# EAGLE design cm4_adc (EAGLE 9.6.2)

## Sheet 1 of 2
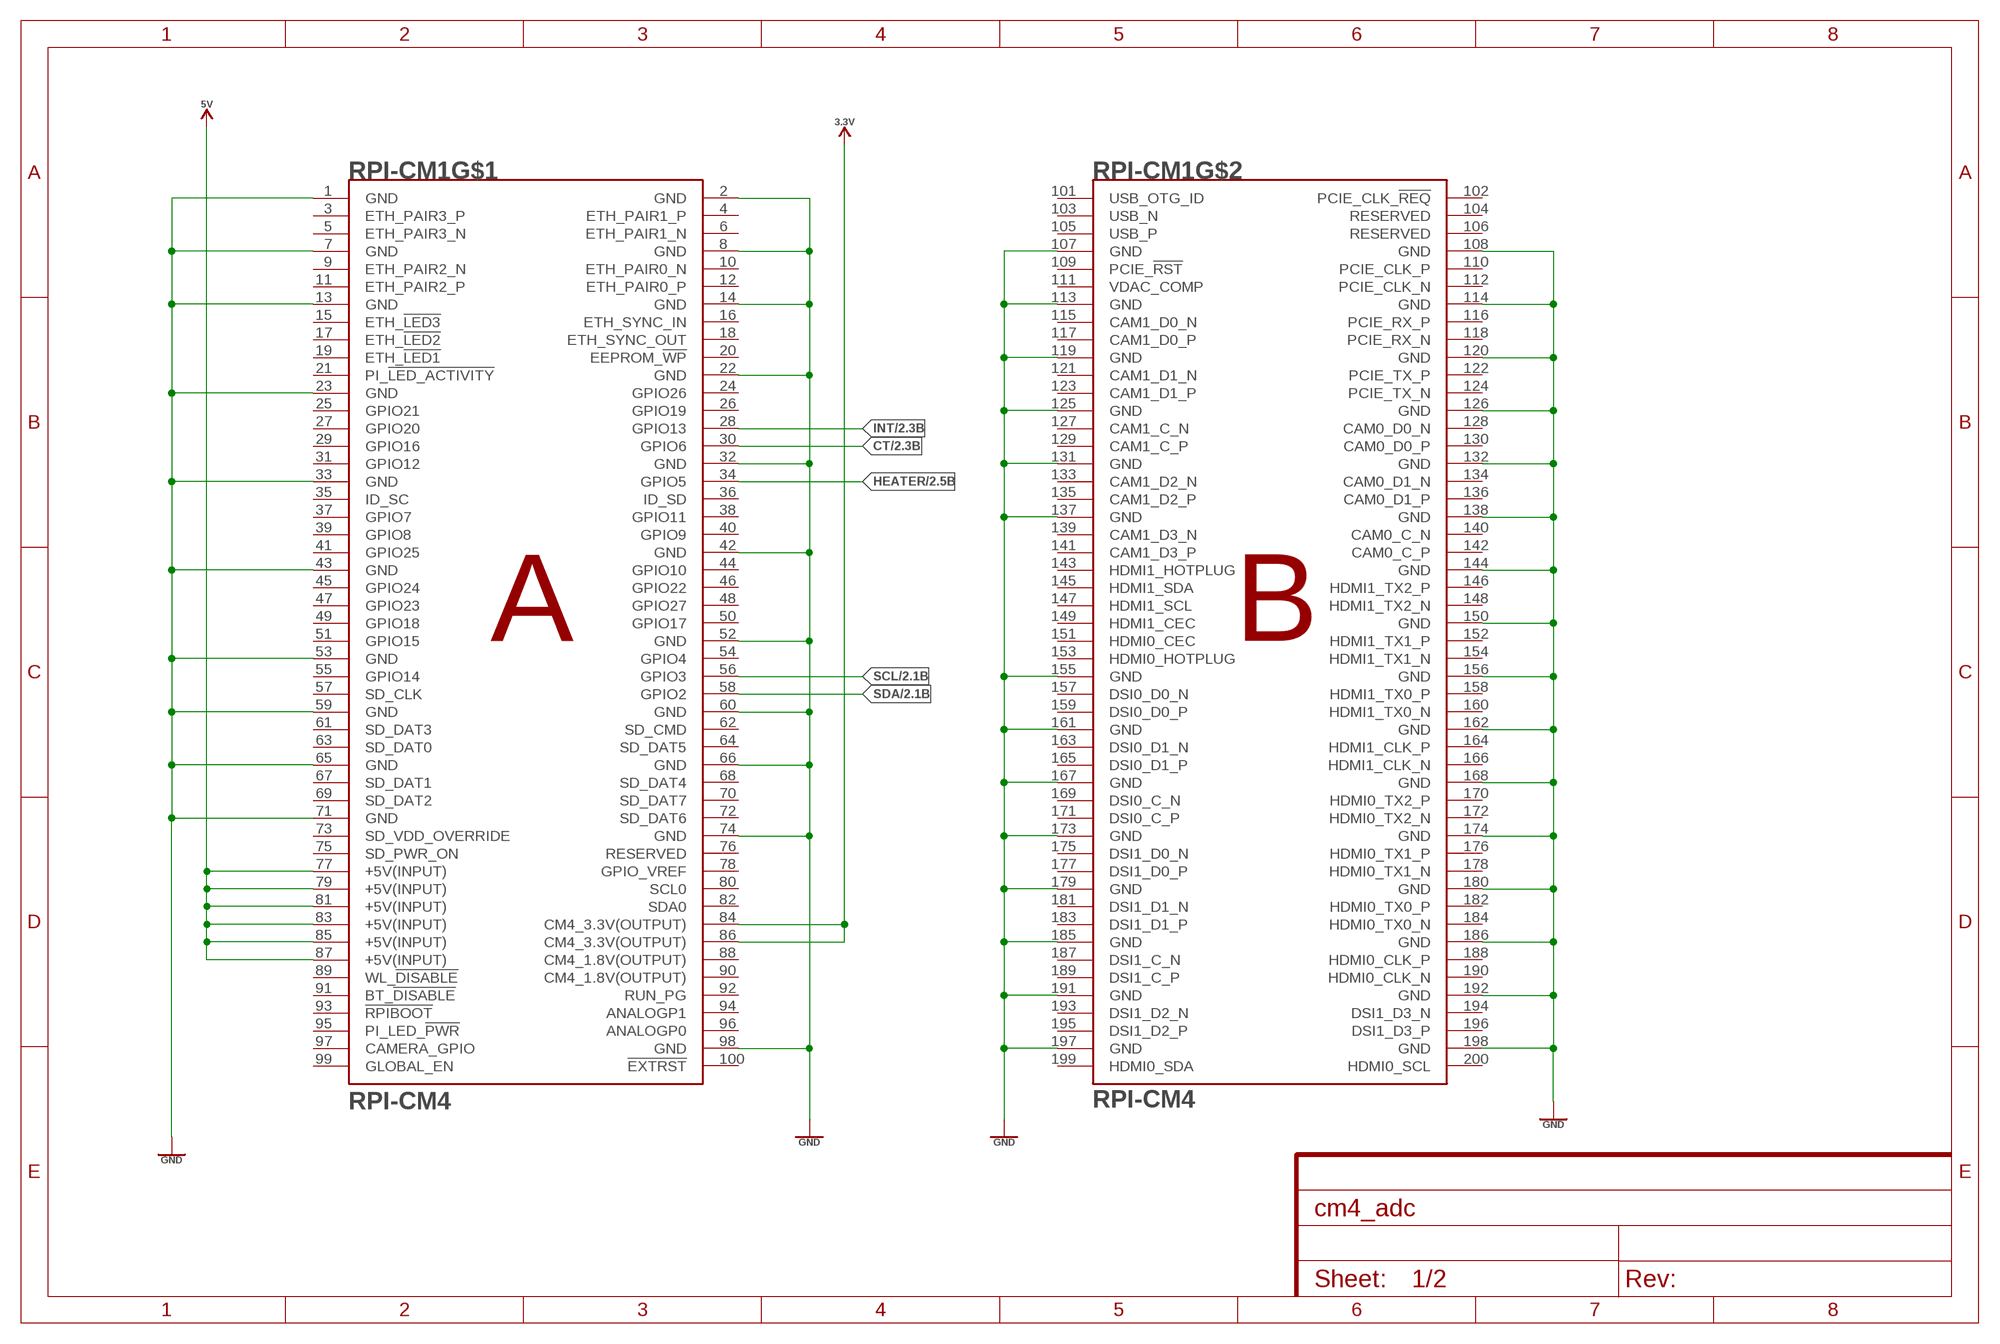
[diagram p0: schematic, sheet 1]

### Parts
RPI-CM1  RPI-CM4  [RPI-CM4]

### Nets
3.3V: RPI-CM1.84(CM4_3.3V(OUTPUT)) RPI-CM1.86(CM4_3.3V(OUTPUT)) ; also sheet 2
5V: RPI-CM1.77(+5V(INPUT)) RPI-CM1.79(+5V(INPUT)) RPI-CM1.81(+5V(INPUT)) RPI-CM1.83(+5V(INPUT)) RPI-CM1.85(+5V(INPUT)) RPI-CM1.87(+5V(INPUT)) ; also sheet 2
CT: RPI-CM1.30(GPIO6) ; also sheet 2
GND: RPI-CM1.1(GND) RPI-CM1.2(GND) RPI-CM1.7(GND) RPI-CM1.8(GND) RPI-CM1.13(GND) RPI-CM1.14(GND) RPI-CM1.22(GND) RPI-CM1.23(GND) RPI-CM1.32(GND) RPI-CM1.33(GND) RPI-CM1.42(GND) RPI-CM1.43(GND) RPI-CM1.52(GND) RPI-CM1.53(GND) RPI-CM1.59(GND) RPI-CM1.60(GND) RPI-CM1.65(GND) RPI-CM1.66(GND) RPI-CM1.71(GND) RPI-CM1.74(GND) RPI-CM1.98(GND) RPI-CM1.107(GND) RPI-CM1.108(GND) RPI-CM1.113(GND) RPI-CM1.114(GND) RPI-CM1.119(GND) RPI-CM1.120(GND) RPI-CM1.125(GND) RPI-CM1.126(GND) RPI-CM1.131(GND) RPI-CM1.132(GND) RPI-CM1.137(GND) RPI-CM1.138(GND) RPI-CM1.144(GND) RPI-CM1.150(GND) RPI-CM1.155(GND) RPI-CM1.156(GND) RPI-CM1.161(GND) RPI-CM1.162(GND) RPI-CM1.167(GND) RPI-CM1.168(GND) RPI-CM1.173(GND) RPI-CM1.174(GND) RPI-CM1.179(GND) RPI-CM1.180(GND) RPI-CM1.185(GND) RPI-CM1.186(GND) RPI-CM1.191(GND) RPI-CM1.192(GND) RPI-CM1.197(GND) RPI-CM1.198(GND) ; also sheet 2
HEATER: RPI-CM1.34(GPIO5) ; also sheet 2
INT: RPI-CM1.28(GPIO13) ; also sheet 2
SCL: RPI-CM1.56(GPIO3) ; also sheet 2
SDA: RPI-CM1.58(GPIO2) ; also sheet 2
Unconnected: RPI-CM1.3(ETH_PAIR3_P) RPI-CM1.4(ETH_PAIR1_P) RPI-CM1.5(ETH_PAIR3_N) RPI-CM1.6(ETH_PAIR1_N) RPI-CM1.9(ETH_PAIR2_N) RPI-CM1.10(ETH_PAIR0_N) RPI-CM1.11(ETH_PAIR2_P) RPI-CM1.12(ETH_PAIR0_P) RPI-CM1.15(ETH_!LED3) RPI-CM1.16(ETH_SYNC_IN) RPI-CM1.17(ETH_!LED2) RPI-CM1.18(ETH_SYNC_OUT) RPI-CM1.19(ETH_!LED1) RPI-CM1.20(EEPROM_!WP) RPI-CM1.21(PI_!LED_ACTIVITY) RPI-CM1.24(GPIO26) RPI-CM1.25(GPIO21) RPI-CM1.26(GPIO19) RPI-CM1.27(GPIO20) RPI-CM1.29(GPIO16) RPI-CM1.31(GPIO12) RPI-CM1.35(ID_SC) RPI-CM1.36(ID_SD) RPI-CM1.37(GPIO7) RPI-CM1.38(GPIO11) RPI-CM1.39(GPIO8) RPI-CM1.40(GPIO9) RPI-CM1.41(GPIO25) RPI-CM1.44(GPIO10) RPI-CM1.45(GPIO24) RPI-CM1.46(GPIO22) RPI-CM1.47(GPIO23) RPI-CM1.48(GPIO27) RPI-CM1.49(GPIO18) RPI-CM1.50(GPIO17) RPI-CM1.51(GPIO15) RPI-CM1.54(GPIO4) RPI-CM1.55(GPIO14) RPI-CM1.57(SD_CLK) RPI-CM1.61(SD_DAT3) RPI-CM1.62(SD_CMD) RPI-CM1.63(SD_DAT0) RPI-CM1.64(SD_DAT5) RPI-CM1.67(SD_DAT1) RPI-CM1.68(SD_DAT4) RPI-CM1.69(SD_DAT2) RPI-CM1.70(SD_DAT7) RPI-CM1.72(SD_DAT6) RPI-CM1.73(SD_VDD_OVERRIDE) RPI-CM1.75(SD_PWR_ON) RPI-CM1.76(RESERVED) RPI-CM1.78(GPIO_VREF) RPI-CM1.80(SCL0) RPI-CM1.82(SDA0) RPI-CM1.88(CM4_1.8V(OUTPUT)) RPI-CM1.89(WL_!DISABLE) RPI-CM1.90(CM4_1.8V(OUTPUT)) RPI-CM1.91(BT_!DISABLE) RPI-CM1.92(RUN_PG) RPI-CM1.93(!RPIBOOT) RPI-CM1.94(ANALOGP1) RPI-CM1.95(PI_LED_!PWR) RPI-CM1.96(ANALOGP0) RPI-CM1.97(CAMERA_GPIO) RPI-CM1.99(GLOBAL_EN) RPI-CM1.100(!EXTRST) RPI-CM1.101(USB_OTG_ID) RPI-CM1.102(PCIE_CLK_!REQ) RPI-CM1.103(USB_N) RPI-CM1.104(RESERVED) RPI-CM1.105(USB_P) RPI-CM1.106(RESERVED) RPI-CM1.109(PCIE_!RST) RPI-CM1.110(PCIE_CLK_P) RPI-CM1.111(VDAC_COMP) RPI-CM1.112(PCIE_CLK_N) RPI-CM1.115(CAM1_D0_N) RPI-CM1.116(PCIE_RX_P) RPI-CM1.117(CAM1_D0_P) RPI-CM1.118(PCIE_RX_N) RPI-CM1.121(CAM1_D1_N) RPI-CM1.122(PCIE_TX_P) RPI-CM1.123(CAM1_D1_P) RPI-CM1.124(PCIE_TX_N) RPI-CM1.127(CAM1_C_N) RPI-CM1.128(CAM0_D0_N) RPI-CM1.129(CAM1_C_P) RPI-CM1.130(CAM0_D0_P) RPI-CM1.133(CAM1_D2_N) RPI-CM1.134(CAM0_D1_N) RPI-CM1.135(CAM1_D2_P) RPI-CM1.136(CAM0_D1_P) RPI-CM1.139(CAM1_D3_N) RPI-CM1.140(CAM0_C_N) RPI-CM1.141(CAM1_D3_P) RPI-CM1.142(CAM0_C_P) RPI-CM1.143(HDMI1_HOTPLUG) RPI-CM1.145(HDMI1_SDA) RPI-CM1.146(HDMI1_TX2_P) RPI-CM1.147(HDMI1_SCL) RPI-CM1.148(HDMI1_TX2_N) RPI-CM1.149(HDMI1_CEC) RPI-CM1.151(HDMI0_CEC) RPI-CM1.152(HDMI1_TX1_P) RPI-CM1.153(HDMI0_HOTPLUG) RPI-CM1.154(HDMI1_TX1_N) RPI-CM1.157(DSI0_D0_N) RPI-CM1.158(HDMI1_TX0_P) RPI-CM1.159(DSI0_D0_P) RPI-CM1.160(HDMI1_TX0_N) RPI-CM1.163(DSI0_D1_N) RPI-CM1.164(HDMI1_CLK_P) RPI-CM1.165(DSI0_D1_P) RPI-CM1.166(HDMI1_CLK_N) RPI-CM1.169(DSI0_C_N) RPI-CM1.170(HDMI0_TX2_P) RPI-CM1.171(DSI0_C_P) RPI-CM1.172(HDMI0_TX2_N) RPI-CM1.175(DSI1_D0_N) RPI-CM1.176(HDMI0_TX1_P) RPI-CM1.177(DSI1_D0_P) RPI-CM1.178(HDMI0_TX1_N) RPI-CM1.181(DSI1_D1_N) RPI-CM1.182(HDMI0_TX0_P) RPI-CM1.183(DSI1_D1_P) RPI-CM1.184(HDMI0_TX0_N) RPI-CM1.187(DSI1_C_N) RPI-CM1.188(HDMI0_CLK_P) RPI-CM1.189(DSI1_C_P) RPI-CM1.190(HDMI0_CLK_N) RPI-CM1.193(DSI1_D2_N) RPI-CM1.194(DSI1_D3_N) RPI-CM1.195(DSI1_D2_P) RPI-CM1.196(DSI1_D3_P) RPI-CM1.199(HDMI0_SDA) RPI-CM1.200(HDMI0_SCL)

## Sheet 2 of 2
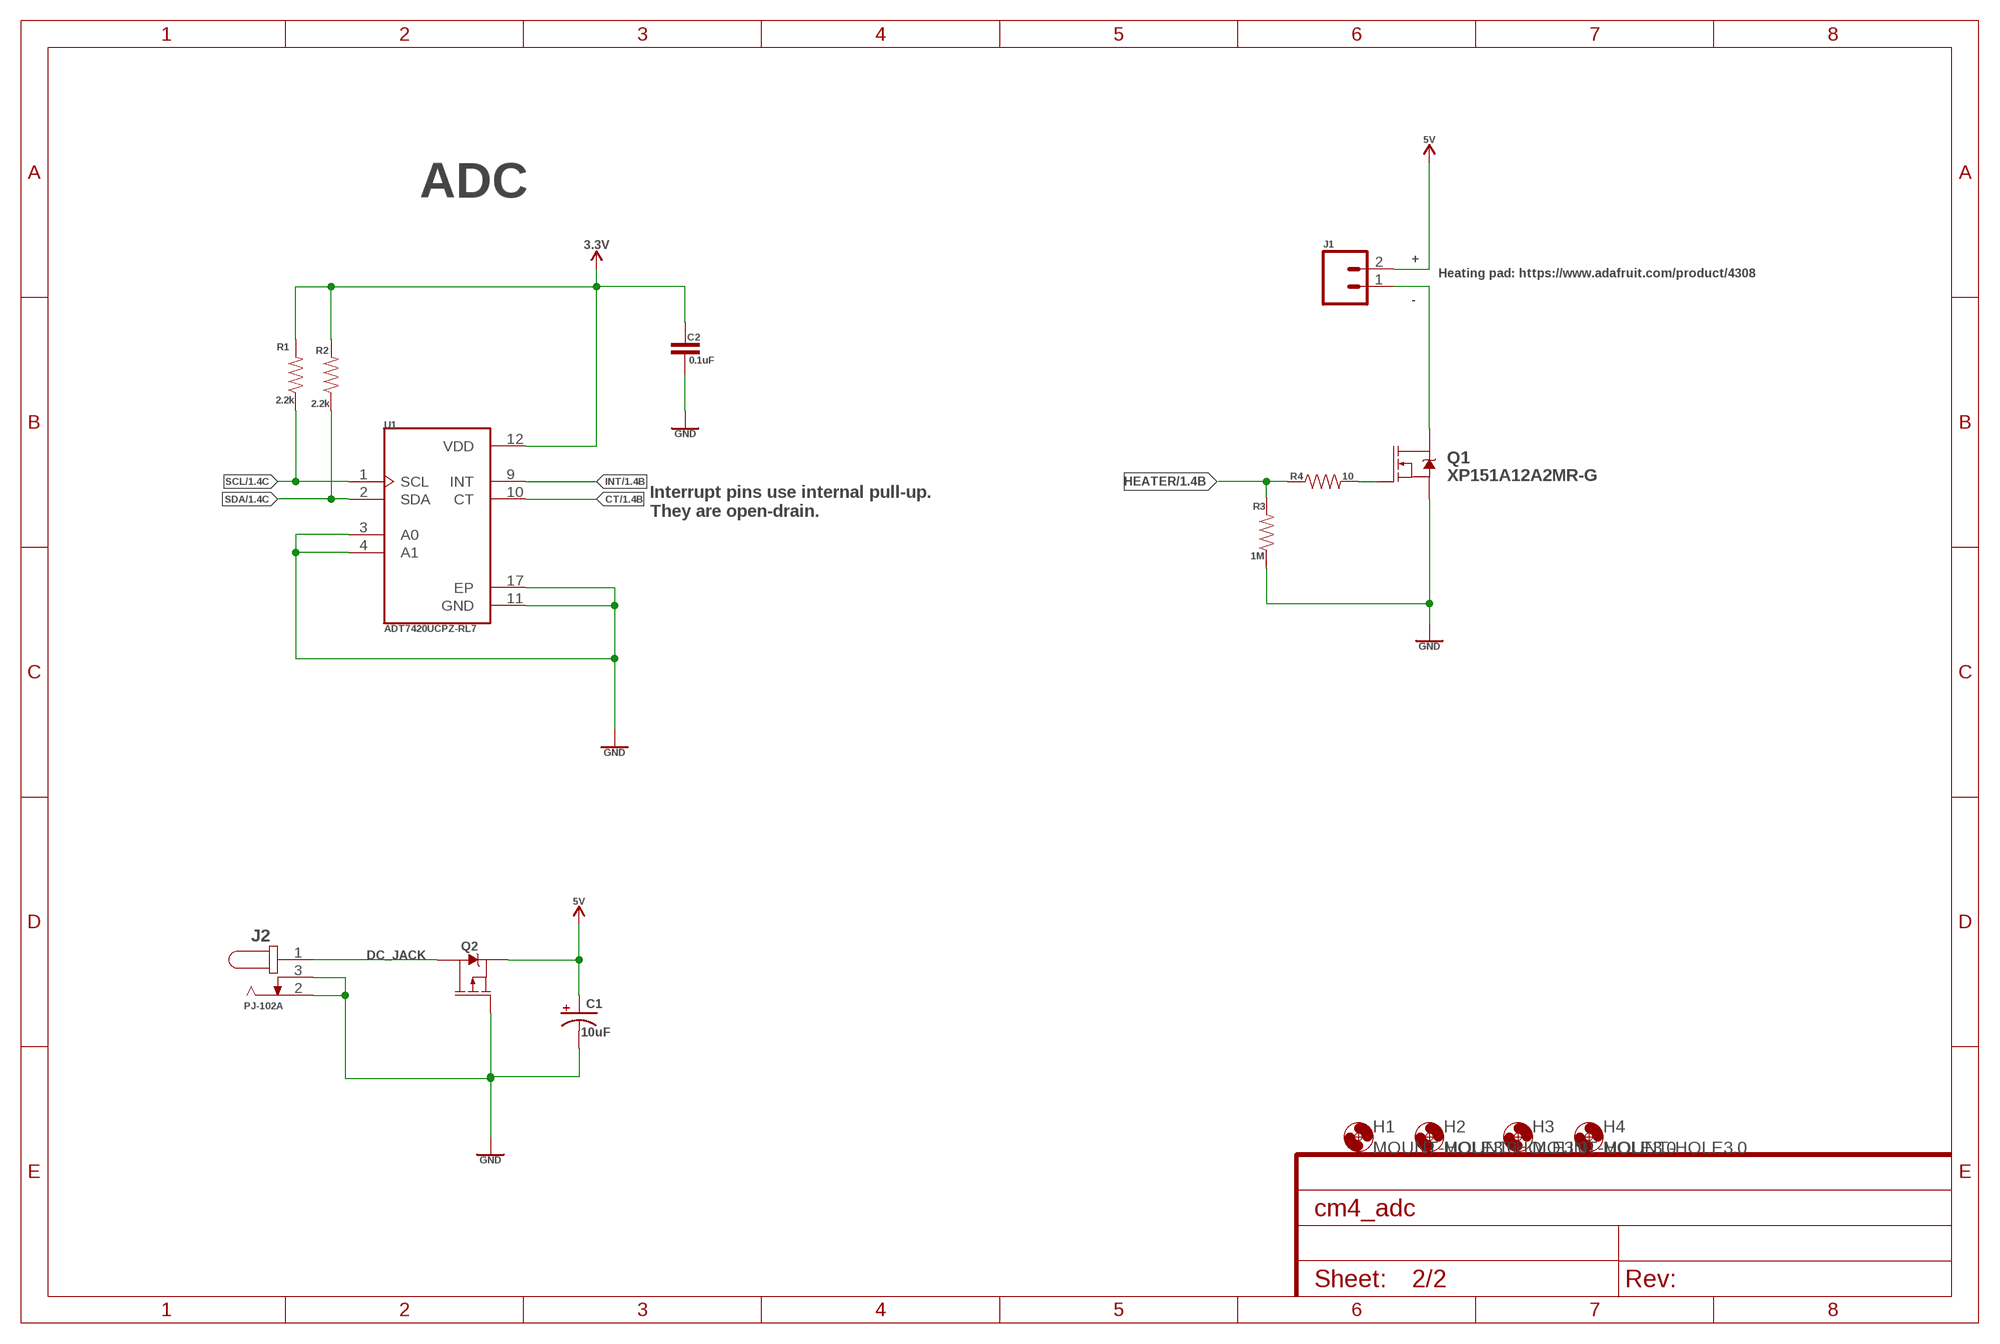
[diagram p1: schematic, sheet 2]

### Parts
C1  10uF  10UF-POLAR-EIA3216-16V-10%(TANT)  [EIA3216]
C2  0.1uF  0.1UF-0603-25V-(+80/-20%)  [0603]
H1  MOUNT-HOLE3.0  [3,0]
H2  MOUNT-HOLE3.0  [3,0]
H3  MOUNT-HOLE3.0  [3,0]
H4  MOUNT-HOLE3.0  [3,0]
J1  CONN_023.5MM  [SCREWTERMINAL-3.5MM-2]
J2  PJ-102A  [CUI_PJ-102A]
Q1  XP151A12A2MR-G  MOSFET-NCH-2N7002PW  [SOT323]
Q2  2.5A/30V/105mΩ  MOSFET_PCH-DMG2307L  [SOT23-3]
R1  2.2k  2.2KOHM-0603-1/10W-1%  [0603]
R2  2.2k  2.2KOHM-0603-1/10W-1%  [0603]
R3  1M  1MOHM-0603-1/4W-5%  [0603]
R4  10  10OHM-0603-1/10W-1%  [0603]
U1  ADT7420UCPZ-RL7  [QFN65P400X400X80-17N]

### Nets
3.3V: C2.1 R1.2 R2.2 U1.12(VDD) ; also sheet 1
5V: C1.+ J1.2 Q2.2(S) ; also sheet 1
CT: U1.10(CT) ; also sheet 1
DC_JACK: J2.1 Q2.3(D)
GND: C1.- C2.2 J2.2 J2.3 Q1.2(S) Q2.1(G) R3.1 U1.3(A0) U1.4(A1) U1.11(GND) U1.17(EP) ; also sheet 1
HEATER: R3.2 R4.1 ; also sheet 1
INT: U1.9(INT) ; also sheet 1
N$1: J1.1 Q1.3(D)
N$2: Q1.1(G) R4.2
SCL: R1.1 U1.1(SCL) ; also sheet 1
SDA: R2.1 U1.2(SDA) ; also sheet 1

### Notes on the sheet
- ADC
- +
- Heating pad: https://www.adafruit.com/product/4308
- -
- Interrupt pins use internal pull-up.
  They are open-drain.

## Library data of the parts
C1 = SparkFun-Capacitors:10UF-POLAR: 10.0µF polarized capacitors A capacitor is a passive two-terminal electrical component used to store electrical energy temporarily in an electric field.; PROD_ID: CAP-00811
C2 = SparkFun-Capacitors:0.1UF: 0.1µF ceramic capacitors A capacitor is a passive two-terminal electrical component used to store electrical energy temporarily in an electric field.; PROD_ID: CAP-00810
H1-H4 = holes:MOUNT-HOLE: MOUNTING HOLE with drill center marker
J1 = SparkFun-Connectors:CONN_02: Multi connection point. Often used as Generic Header-pin footprint for 0.1 inch spaced/style header connections On any of the 0.1 inch spaced packages, you can populate with these: Break Away Headers - Straight <https://www.sparkfun.com/products/116> (PRT-00116) Break Away Male Headers - Right Angle <https://www.sparkfun.com/products/553> (PRT-00553) Female Headers <https://www.sparkfun.com/products/115> (PRT-00115) Break Away Headers - Machine Pin <https://www.sparkfun.com/products/117> (PRT-00117) Break Away Female Headers - Swiss Machine Pin <https://www.sparkfun.com/products/743> (PRT-00743) For SCREWTERMINALS and SPRING TERMINALS visit here: Screw Terimnals on SparkFun.com <https://www.sparkfun.com/search/results?term=Screw+Terminals> (5mm/3.5mm/2.54mm spacing) This device is also useful as a general connection point to wire up your design to another part of your project. Our various solder wires solder well into these plated through hole pads. Hook-Up Wire - Assortment (Stranded, 22 AWG) <https://www.sparkfun.com/products/11375> (PRT-11375) Hook-Up Wire - Assortment (Solid Core, 22 AWG) <https://www.sparkfun.com/products/11367> (PRT-11367) View the entire wire category on our website here <https://www.sparkfun.com/categories/141> Special notes: Molex polarized connector foot print use with: PRT-08233 with associated crimp pins and housings. 2.54_SCREWTERM for use with PRT-10571. 3.5mm Screw Terminal footprints for PRT-08084 5mm Screw Terminal footprints for use with PRT-08432; PROD_ID: CONN-08399
J2 = PJ-102A:PJ-102A: 2.0 mm Center Pin, 2.5 A, Right Angle, Through Hole, Tapered Pins, Dc Power Jack Connector; MANUFACTURER: CUI INC; PART_REV: 1.03; STANDARD: Manufacturer recommendations
Q1 = SparkFun-DiscreteSemi:MOSFET-NCH: N-channel MOSFETs Voltage controlled devices that allow control of high current outputs. SparkFun Products: SparkFun OpenScale <https://www.sparkfun.com/products/13261> SparkFun Digital Sandbox <https://www.sparkfun.com/products/12651> SparkFun Monster Moto Shield <https://www.sparkfun.com/products/10182> SparkFun MOSFET Power Controller <https://www.sparkfun.com/products/11214>; PROD_ID: TRANS-11151; VALUE: 310mA/60V/1.6Ω
Q2 = SparkFun-DiscreteSemi:MOSFET_PCH: P-channel MOSFETs Voltage controlled devices that allow control of high current outputs. SparkFun Products: SparkFun ESP32 Thing <https://www.sparkfun.com/products/13907> SparkFun ESP8266 Thing <https://www.sparkfun.com/products/13231>; PROD_ID: TRANS-11308
R1 R2 = SparkFun-Resistors:2.2KOHM: 2.2kΩ resistor A resistor is a passive two-terminal electrical component that implements electrical resistance as a circuit element. Resistors act to reduce current flow, and, at the same time, act to lower voltage levels within circuits. - Wikipedia; PROD_ID: RES-08272
R3 = SparkFun-Resistors:1MOHM: 1MΩ resistor A resistor is a passive two-terminal electrical component that implements electrical resistance as a circuit element. Resistors act to reduce current flow, and, at the same time, act to lower voltage levels within circuits. - Wikipedia; PROD_ID: RES-07868
R4 = SparkFun-Resistors:10OHM: 10Ω resistor A resistor is a passive two-terminal electrical component that implements electrical resistance as a circuit element. Resistors act to reduce current flow, and, at the same time, act to lower voltage levels within circuits. - Wikipedia; PROD_ID: RES-12581
RPI-CM1 = RPI-CM4:RPI-CM4
U1 = ADT7420UCPZ-RL7:ADT7420UCPZ-RL7: Temp Sensor Digital Serial (I2C) 16-Pin LFCSP EP T/R Check availability <https://pricing.snapeda.com/parts/ADT7420UCPZ-RL7/Analog%20Devices/view-part?ref=eda>; AVAILABILITY: In Stock; DESCRIPTION: Temperature Sensor Digital, Local -40°C ~ 150°C 15 b 16-LFCSP-WQ (4x4); MF: Analog Devices; MP: ADT7420UCPZ-RL7; PACKAGE: LFCSP -16 Analog Devices; PRICE: None; PURCHASE-URL: https://pricing.snapeda.com/search/part/ADT7420UCPZ-RL7/?ref=eda

## Board
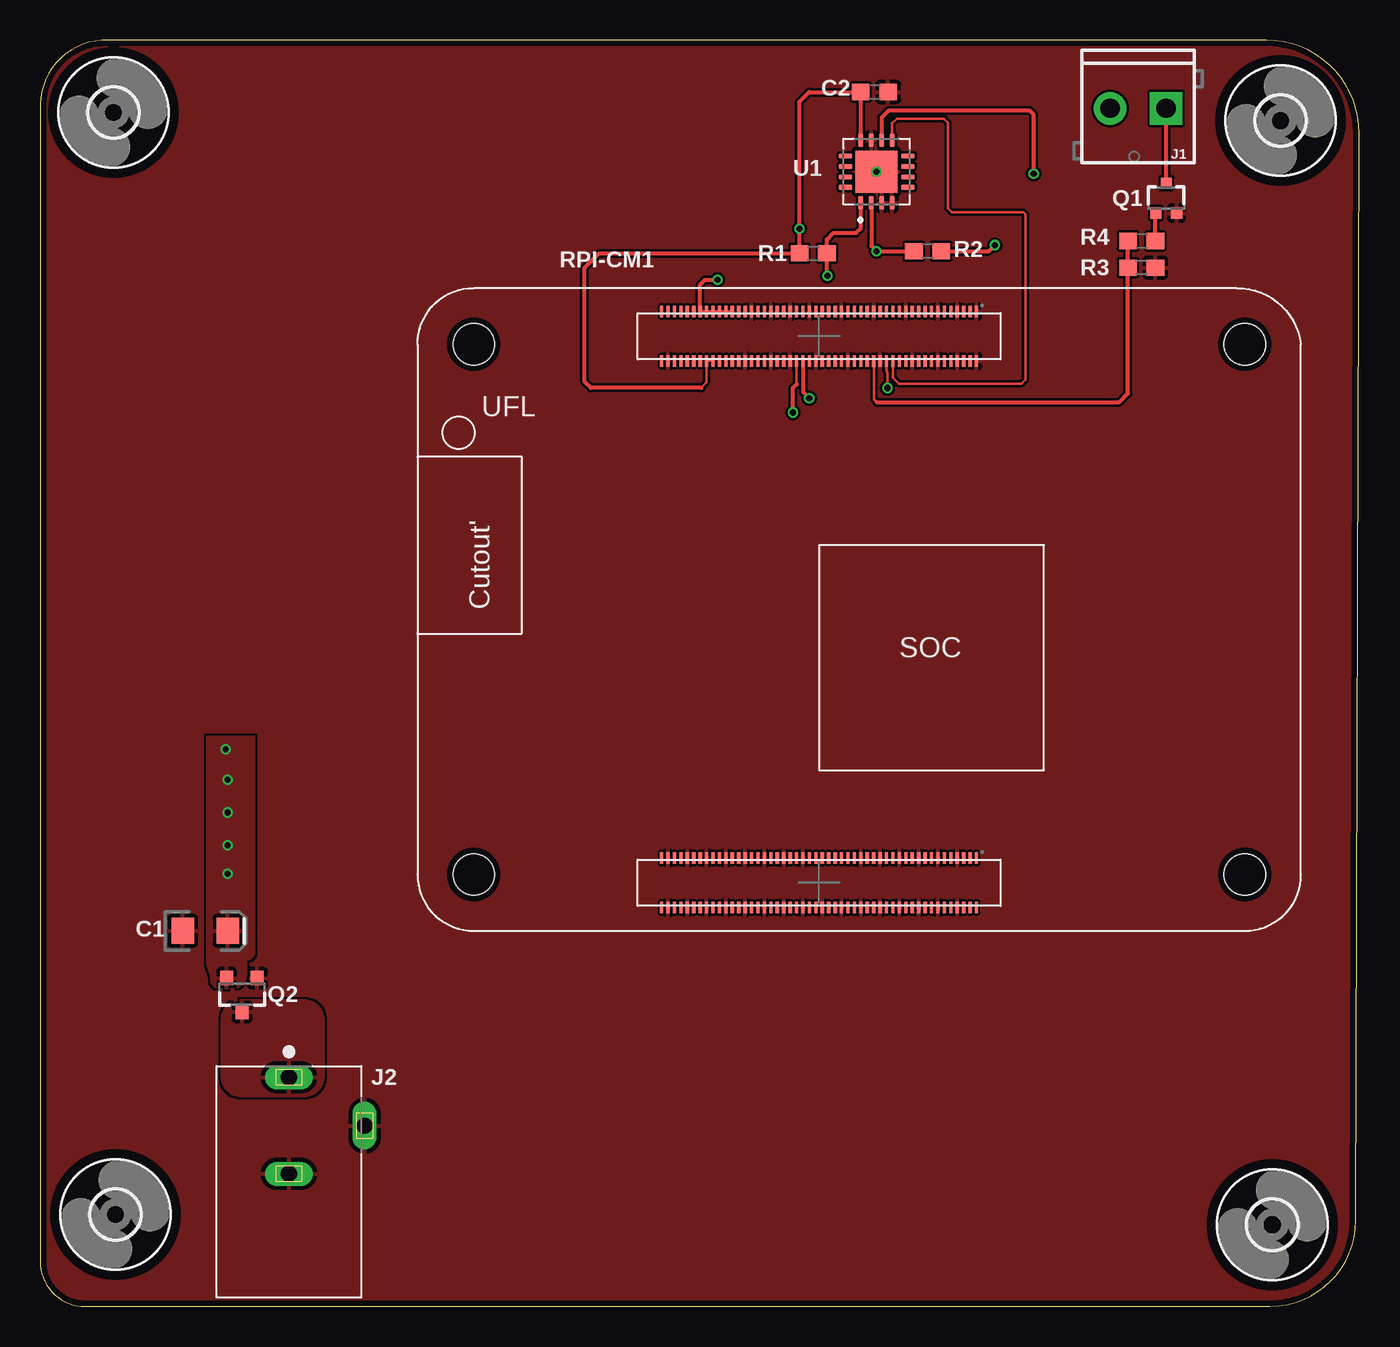
[diagram p2: board, top side]
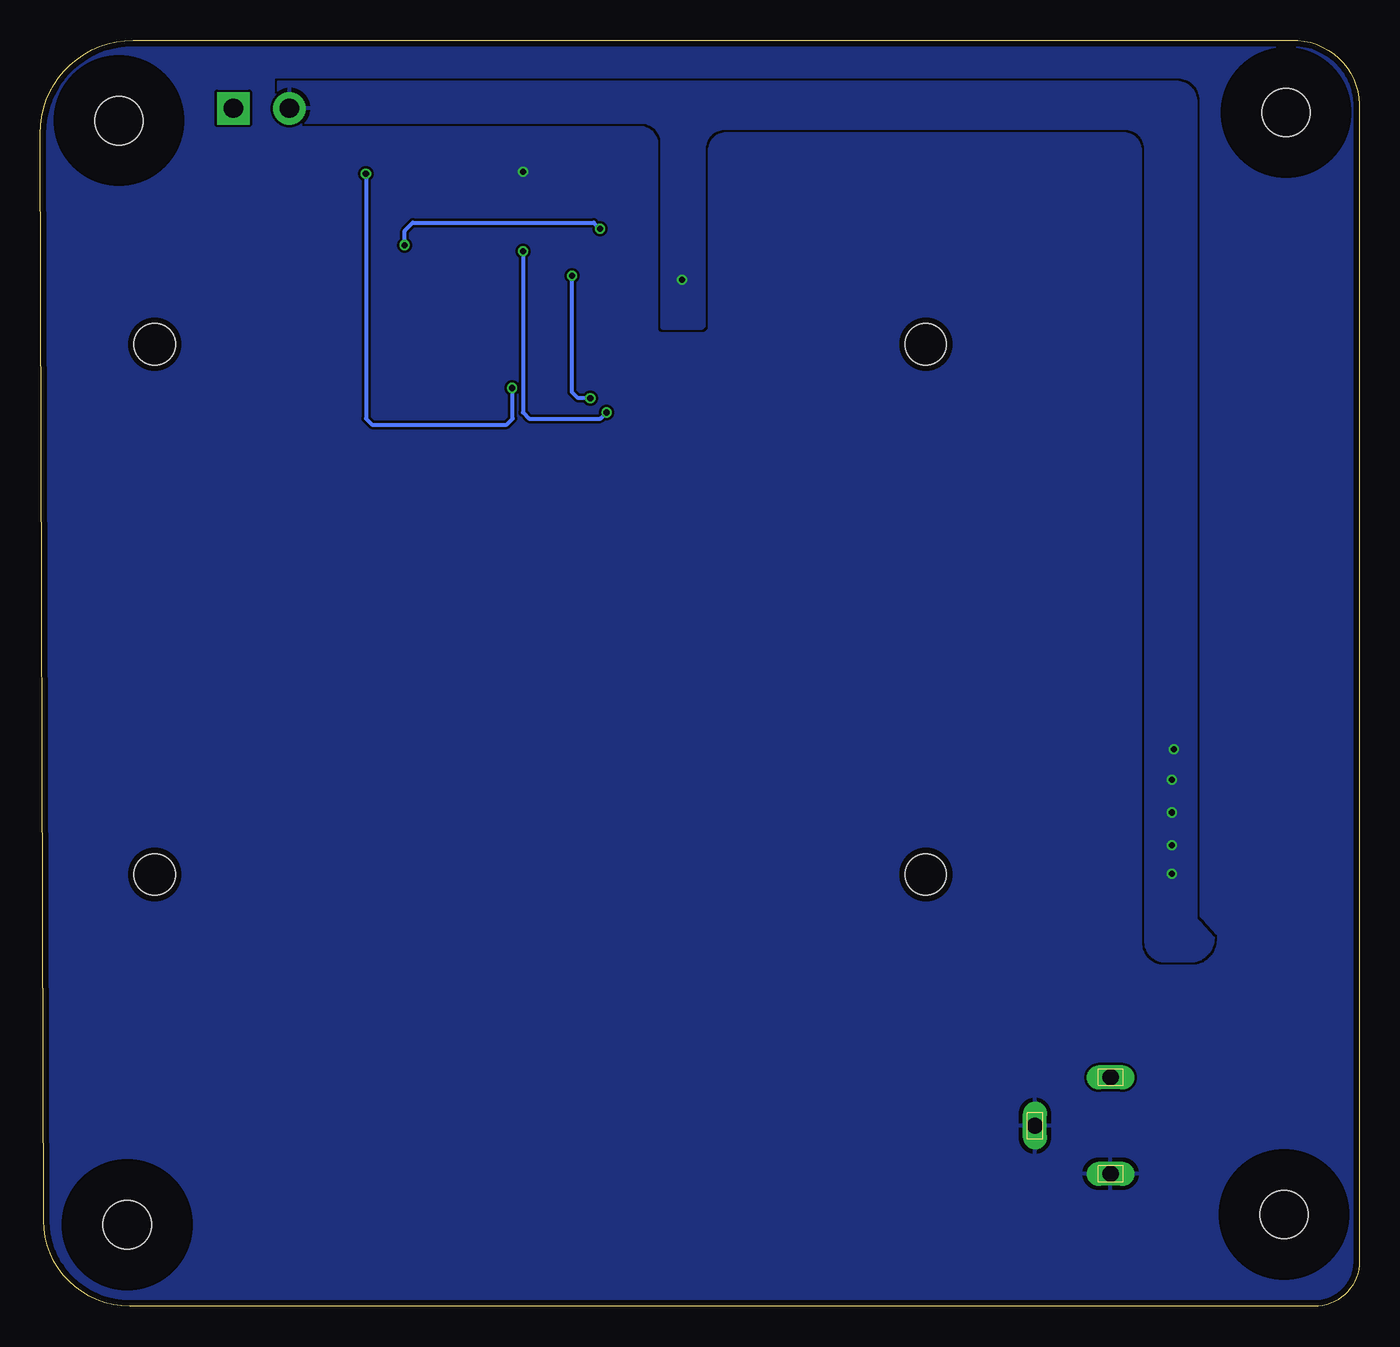
[diagram p3: board, bottom side, seen from below]

Size 82.12 x 78.79 mm. Coordinates in mm from the lower left corner, seen from the top.
Outline: 76.32,78.79 4.23,78.79 arc90 0,74.81 0,2.81 arc90 2.8,0 76.54,0 arc90 81.9,5.34 82.12,72.97 arc90 76.32,78.79
Copper layers (1*16): Top 0.035559375mm / dielectric 1.6mm / Bottom 0.035559375mm
Design rules "oshpark-2layer": minimum track width 6mil, minimum drill 10mil, track to track 6mil, track to pad 6mil, pad to pad 6mil, via to via 6mil, smd to smd 6mil, copper to edge 15mil, drill to drill 6mil, minimum pad ring 5mil, minimum via ring 5mil, stop-mask expansion 2.5mil, vias tented up to drill 0mil, thermal gap 10mil

### Footprints (pad centres in the part's own frame; a part is rotated, then mirrored left to right if it is on the bottom)
EIA3216 = smd 1.4 x 1.6: + 1.4,0; - -1.4,0
0603 = smd 1.1 x 1: 1 -0.85,0; 2 0.85,0
3,0 = hole 3: 0,0
SCREWTERMINAL-3.5MM-2 = drill 1.2 pad 2.032 square: 1 0,0 | drill 1.2 pad 2.032: 2 3.5,0
CUI_PJ-102A = drill 1 long: 1 -6.5,0; 2 -0.5,0; 3 -3.5,4.7
SOT323 = smd 0.7 x 0.7: 1 -0.65,-0.925; 2 0.65,-0.925; 3 0,0.925
SOT23-3 = smd 0.8 x 0.9: 1 -0.95,-1; 2 0.95,-1; 3 0,1.1
RPI-CM4 = smd 0.2 x 0.7: 1 34.8,38.54; 2 34.8,35.46; 3 34.4,38.54; 4 34.4,35.46; 5 34,38.54; 6 34,35.46; 7 33.6,38.54; 8 33.6,35.46; 9 33.2,38.54; 10 33.2,35.46; 11 32.8,38.54; 12 32.8,35.46; 13 32.4,38.54; 14 32.4,35.46; 15 32,38.54; 16 32,35.46; 17 31.6,38.54; 18 31.6,35.46; 19 31.2,38.54; 20 31.2,35.46; 21 30.8,38.54; 22 30.8,35.46; 23 30.4,38.54; 24 30.4,35.46; 25 30,38.54; 26 30,35.46; 27 29.6,38.54; 28 29.6,35.46; 29 29.2,38.54; 30 29.2,35.46; 31 28.8,38.54; 32 28.8,35.46; 33 28.4,38.54; 34 28.4,35.46; 35 28,38.54; 36 28,35.46; 37 27.6,38.54; 38 27.6,35.46; 39 27.2,38.54; 40 27.2,35.46; 41 26.8,38.54; 42 26.8,35.46; 43 26.4,38.54; 44 26.4,35.46; 45 26,38.54; 46 26,35.46; 47 25.6,38.54; 48 25.6,35.46; 49 25.2,38.54; 50 25.2,35.46; 51 24.8,38.54; 52 24.8,35.46; 53 24.4,38.54; 54 24.4,35.46; 55 24,38.54; 56 24,35.46; 57 23.6,38.54; 58 23.6,35.46; 59 23.2,38.54; 60 23.2,35.46; 61 22.8,38.54; 62 22.8,35.46; 63 22.4,38.54; 64 22.4,35.46; 65 22,38.54; 66 22,35.46; 67 21.6,38.54; 68 21.6,35.46; 69 21.2,38.54; 70 21.2,35.46; 71 20.8,38.54; 72 20.8,35.46; 73 20.4,38.54; 74 20.4,35.46; 75 20,38.54; 76 20,35.46; 77 19.6,38.54; 78 19.6,35.46; 79 19.2,38.54; 80 19.2,35.46; 81 18.8,38.54; 82 18.8,35.46; 83 18.4,38.54; 84 18.4,35.46; 85 18,38.54; 86 18,35.46; 87 17.6,38.54; 88 17.6,35.46; 89 17.2,38.54; 90 17.2,35.46; 91 16.8,38.54; 92 16.8,35.46; 93 16.4,38.54; 94 16.4,35.46; 95 16,38.54; 96 16,35.46; 97 15.6,38.54; 98 15.6,35.46; 99 15.2,38.54; 100 15.2,35.46; 101 34.8,4.54; 102 34.8,1.46; 103 34.4,4.54; 104 34.4,1.46; 105 34,4.54; 106 34,1.46; 107 33.6,4.54; 108 33.6,1.46; 109 33.2,4.54; 110 33.2,1.46; 111 32.8,4.54; 112 32.8,1.46; 113 32.4,4.54; 114 32.4,1.46; 115 32,4.54; 116 32,1.46; 117 31.6,4.54; 118 31.6,1.46; 119 31.2,4.54; 120 31.2,1.46; 121 30.8,4.54; 122 30.8,1.46; 123 30.4,4.54; 124 30.4,1.46; 125 30,4.54; 126 30,1.46; 127 29.6,4.54; 128 29.6,1.46; 129 29.2,4.54; 130 29.2,1.46; 131 28.8,4.54; 132 28.8,1.46; 133 28.4,4.54; 134 28.4,1.46; 135 28,4.54; 136 28,1.46; 137 27.6,4.54; 138 27.6,1.46; 139 27.2,4.54; 140 27.2,1.46; 141 26.8,4.54; 142 26.8,1.46; 143 26.4,4.54; 144 26.4,1.46; 145 26,4.54; 146 26,1.46; 147 25.6,4.54; 148 25.6,1.46; 149 25.2,4.54; 150 25.2,1.46; 151 24.8,4.54; 152 24.8,1.46; 153 24.4,4.54; 154 24.4,1.46; 155 24,4.54; 156 24,1.46; 157 23.6,4.54; 158 23.6,1.46; 159 23.2,4.54; 160 23.2,1.46; 161 22.8,4.54; 162 22.8,1.46; 163 22.4,4.54; 164 22.4,1.46; 165 22,4.54; 166 22,1.46; 167 21.6,4.54; 168 21.6,1.46; 169 21.2,4.54; 170 21.2,1.46; 171 20.8,4.54; 172 20.8,1.46; 173 20.4,4.54; 174 20.4,1.46; 175 20,4.54; 176 20,1.46; 177 19.6,4.54; 178 19.6,1.46; 179 19.2,4.54; 180 19.2,1.46; 181 18.8,4.54; 182 18.8,1.46; 183 18.4,4.54; 184 18.4,1.46; 185 18,4.54; 186 18,1.46; 187 17.6,4.54; 188 17.6,1.46; 189 17.2,4.54; 190 17.2,1.46; 191 16.8,4.54; 192 16.8,1.46; 193 16.4,4.54; 194 16.4,1.46; 195 16,4.54; 196 16,1.46; 197 15.6,4.54; 198 15.6,1.46; 199 15.2,4.54; 200 15.2,1.46 | hole 2.55: 3.5,3.5; 3.5,36.5; 51.5,36.5; 51.5,3.5
QFN65P400X400X80-17N = smd 0.84 x 0.32: 1 -1.945,0.975; 2 -1.945,0.325; 3 -1.945,-0.325; 4 -1.945,-0.975; 9 1.945,-0.975; 10 1.945,-0.325; 11 1.945,0.325; 12 1.945,0.975 | smd 0.32 x 0.84: 5 -0.975,-1.945; 6 -0.325,-1.945; 7 0.325,-1.945; 8 0.975,-1.945; 13 0.975,1.945; 14 0.325,1.945; 15 -0.325,1.945; 16 -0.975,1.945 | smd 2.6 x 2.6: 17 0,0

### Placement (x,y rotation side)
C1  10.28,23.37 0 top
C2  51.93,75.56 0 top
H1  76.7,5.08 0 top
H2  4.69,5.71 0 top
H3  77.21,73.79 0 top
H4  4.56,74.3 0 top
J1  70.09,74.55 180 top
J2  15.48,7.75 270 top
Q1  70.09,68.96 0 top
Q2  12.56,19.43 180 top
R1  48.12,65.53 180 top
R2  55.24,65.66 0 top
R3  68.57,64.64 180 top
R4  68.57,66.29 0 top
RPI-CM1  23.49,23.37 0 top
U1  52.06,70.61 90 top

### Tracks (layer width: path | path; a pad name or v marks a point on that pad's centre or on a via)
3.3V  (via drill 0.38)
  Top 0.152: RPI-CM1.84 RPI-CM1.86 41.49,57.5 41.14,57.15
  Top 0.254: U1.12 C2.1 47.87,75.56 47.27,74.97 v47.27,67.06 R1.2 34.79,65.53 33.9,64.64 33.9,57.53 34.28,57.15 41.14,57.15 | R2.2 59.05,65.66 v59.43,66.04
  Bottom 0.254: v59.43,66.04 59.43,66.93 58.92,67.44 47.65,67.44 v47.27,67.06
5V  (via drill 0.38)
  Top 0.152: RPI-CM1.87 RPI-CM1.85 RPI-CM1.83 RPI-CM1.81 RPI-CM1.79 RPI-CM1.77
  Top 0.254: RPI-CM1.87 41.09,63.57 41.39,63.88 v42.15,63.88
  other vias: 11.55,34.67 11.67,32.77 11.67,30.73 11.67,28.7 11.67,26.92
  pour Top: 10.4,21.34 10.4,35.43 13.33,35.43 13.33,22.1 arc-90 12.82,21.59 12.82,20.7 arc-90 11.93,19.81 11.17,19.81 arc-90 10.66,20.32 10.66,20.57
  pour Bottom: 10.15,24.13 10.15,74.93 arc-90 11.42,76.2 67.3,76.2 67.3,73.66 44.69,73.66 arc90 43.42,72.39 43.42,60.96 arc-90 43.3,60.83 41.01,60.83 arc-90 40.76,61.09 40.76,72.01 arc90 39.49,73.28 14.6,73.28 arc90 13.33,72.01 13.33,22.73 arc-90 12.06,21.46 10.53,21.46 arc-90 9.07,22.92 9.9,23.88
CT  (via drill 0.38)
  Top 0.152: v52.73,57.15 52.73,58.13 52.69,58.18 RPI-CM1.30
  Top 0.254: U1.10 52.39,73.98 52.82,74.42 61.59,74.42 61.84,74.17 v61.84,70.48
  Bottom 0.254: v61.84,70.48 61.84,55.24 61.46,54.86 53.08,54.86 52.7,55.24 52.7,57.11 v52.73,57.15
DC_JACK
  pour Top: 12.69,19.05 16.37,19.05 arc-90 17.64,17.78 17.64,14.35 arc-90 16.37,13.08 14.09,13.08 12.56,13.08 arc-90 11.29,14.35 11.29,17.14 11.29,17.78 arc-90 12.56,19.05
GND  (via drill 0.38)
  other vias: 52.06,70.61
  pour Top (rank 6): -5.09,0 -5.09,77.47 arc-90 -3.82,78.74 82.54,78.74 82.54,1.27 arc-90 81.27,0
  pour Bottom (rank 6): -5.09,0 -5.09,76.2 arc-90 -2.55,78.74 82.54,78.74 82.54,1.27 arc-90 81.27,0
HEATER
  Top 0.152: RPI-CM1.34 51.89,56.44 52.06,56.26
  Top 0.254: R4.1 R3.2 67.72,56.81 67.17,56.26 52.06,56.26
INT
  Top 0.152: RPI-CM1.28 53.09,57.78 53.46,57.4 61.08,57.4 61.33,57.66 61.33,67.94 61.2,68.07 56.76,68.07 56.51,68.33 56.51,73.66 56.25,73.91 53.33,73.91 53.04,73.62 U1.9
N$1
  Top 0.254: Q1.3 J1.1
N$2
  Top 0.254: R4.2 69.42,68.01 Q1.1
SCL  (via drill 0.38)
  Top 0.254: RPI-CM1.56 47.49,56.9 v47.87,56.52 | v49.01,64.14 48.97,64.17 R1.1 48.97,66.38 49.39,66.8 50.79,66.8 51.09,67.1 U1.1
  Bottom 0.254: v47.87,56.52 48.63,56.52 49.01,56.9 v49.01,64.14
SDA  (via drill 0.38)
  Top 0.152: 47.08,57.4 RPI-CM1.58
  Top 0.254: U1.2 51.74,65.98 v52.06,65.66 R2.1 | v46.85,55.63 46.85,57.15 47.08,57.38 47.08,57.4
  Bottom 0.254: v46.85,55.63 47.23,55.24 51.68,55.24 52.06,55.63 v52.06,65.66